# Altium schematic sheet Schematic.SchDoc
size Legal
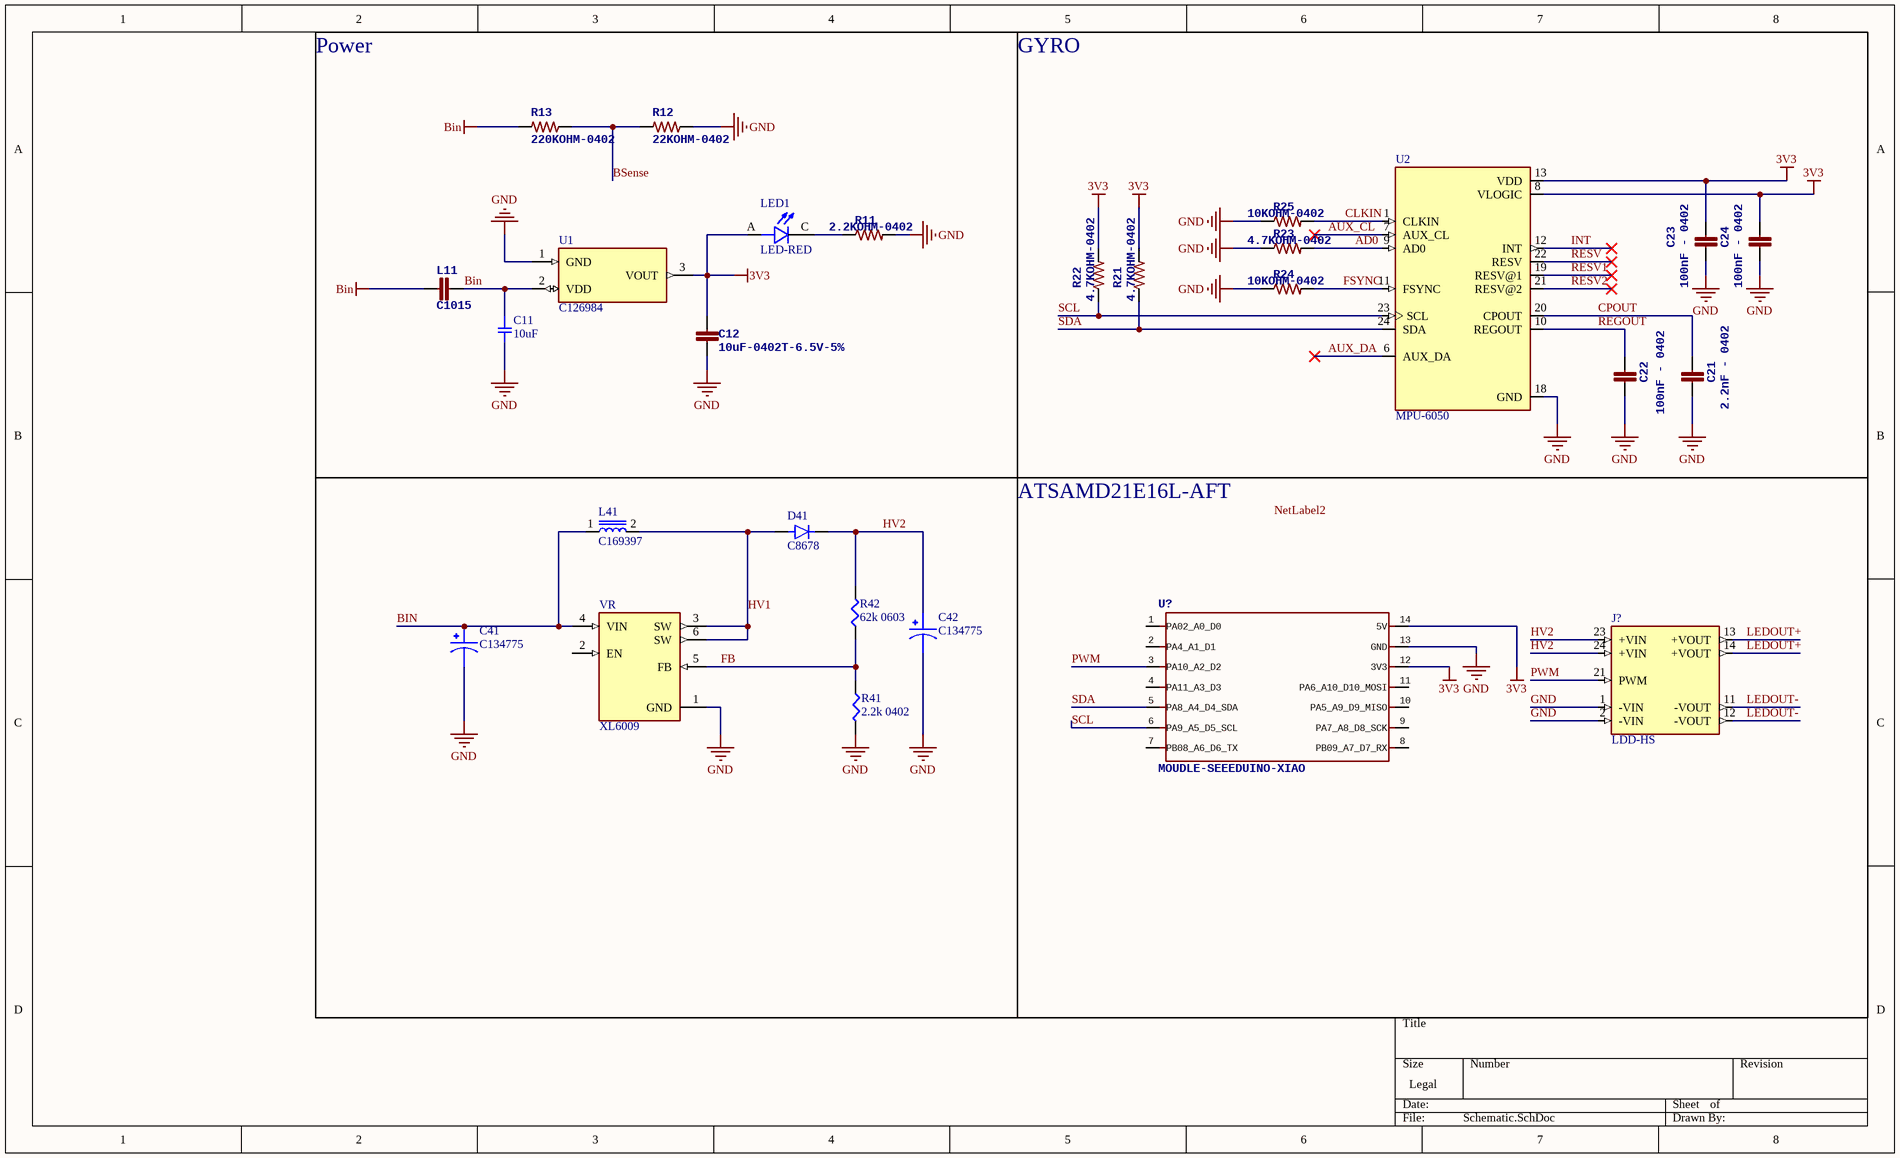
[diagram p0: Schematic.SchDoc]

## Parts
C11  10uF  [SMD-1206C]
C12  10uF-0402T-6.5V-5%  [0402-TIGHT]
C21  2.2nF - 0402  [0402]
C22  100nF - 0402  [0402]
C23  100nF - 0402  [0402]
C24  100nF - 0402  [0402]
C41  C134775  [CAPAE660X800N]
C42  C134775  [CAPAE660X800N]
D41  C8678  [DIOM5227X270N]
J?  LDD-HS  [LDD-HS]
L11  C1015  [0805]
L41  C169397  [INDM1250X1250X600]
LED1  LED-RED  [LEDSC160X80X90-2N]
R11  2.2KOHM-0402  [0402_MURATA]
R12  22KOHM-0402  [0402_MURATA]
R13  220KOHM-0402  [0402_MURATA]
R21  4.7KOHM-0402  [0402_MURATA]
R22  4.7KOHM-0402  [0402_MURATA]
R23  4.7KOHM-0402  [0402_MURATA]
R24  10KOHM-0402  [0402_MURATA]
R25  10KOHM-0402  [0402_MURATA]
R41  2.2k 0402  [SMD-0402-RES]
R42  62k 0603  [SMD-0603-RES]
U1  C126984  [VREG_TL431AQPK]
U2  MPU-6050  [QFN50P400X400X95-24N]
U?  MOUDLE-SEEEDUINO-XIAO  [MOUDLE14P-2.54-21X17.8MM]
VR  XL6009  [DPAK170P1435X465-6N]

## Blocks framed on the sheet
GYRO: C21-C24 R21-R25 U2

## Nets
3V3: C12.1 C23.2 C24.2 LED1.A R21.P$2 R22.P$2 U1.3(VOUT) U2.8(VLOGIC) U2.13(VDD) U?.12(3V3) U?.14(5V)
Bin: C11.1 C41.1 L11.1 L11.2 L41.1 R13.P$2 U1.2(VDD) VR.4(VIN)
GND: C11.2 C12.2 C21.1 C22.2 C23.1 C24.1 C41.2 C42.2 J?.1(-VIN) J?.2(-VIN) R11.P$2 R12.P$1 R23.P$1 R24.P$1 R25.P$1 R41.2 U1.1(GND) U2.18(GND) U?.13(GND) VR.1(GND)
AD0: R23.P$2 U2.9(AD0)
AUX_CL: U2.7(AUX_CL)
AUX_DA: U2.6(AUX_DA)
BSense: R12.P$2 R13.P$1
CLKIN: R25.P$2 U2.1(CLKIN)
CPOUT: C21.2 U2.20(CPOUT)
FB: R41.1 R42.1 VR.5(FB)
FSYNC: R24.P$2 U2.11(FSYNC)
HV1: D41.A L41.2 VR.3(SW) VR.6(SW)
HV2: C42.1 D41.C(K) J?.23(+VIN) J?.24(+VIN) R42.2
INT: U2.12(INT)
LEDOUT+: J?.13(+VOUT) J?.14(+VOUT)
LEDOUT-: J?.11(-VOUT) J?.12(-VOUT)
PWM: J?.21(PWM) U?.3(PA10_A2_D2)
REGOUT: C22.1 U2.10(REGOUT)
RESV: U2.22(RESV)
RESV1: U2.19(RESV@1)
RESV2: U2.21(RESV@2)
SCL: R22.P$1 U2.23(SCL) U?.6(PA9_A5_D5_SCL)
SDA: R21.P$1 U2.24(SDA) U?.5(PA8_A4_D4_SDA)
NetLED1_C: LED1.C R11.P$1

Not connected (* = marked no-connect by the designer): U? 1(PA02_A0_D0) 2(PA4_A1_D1) 4(PA11_A3_D3) 7(PB08_A6_D6_TX) 8(PB09_A7_D7_RX) 9(PA7_A8_D8_SCK) 10(PA5_A9_D9_MISO) 11(PA6_A10_D10_MOSI); VR 2(EN)

## Notes on the sheet
- Power
- ATSAMD21E16L-AFT
- Labels drawn without touching a wire or pin: NetLabel2

## Library data of the parts
C11 = GCJ31CR71A106KA13L: C13585; Manufacturer: Murata Electronics North America; Factory Stock: 0; Unit Price (USD): 0.71; Minimum Quantity: 1; Value: 10µF; Tolerance: ±10%; Voltage: 10V; Temperature Coefficient: X7R; Datasheets: http://www.murata.com/~/media/webrenewal/support/library/catalog/products/capacitor/mlcc/c03e.ashx; Image: //media.digikey.com/Renders/Murata%20Renders/GR331BD72E473KW01L.jpg; Digi-Key Part Number: 490-5848-1-ND; Part Number: GCJ31CR71A106KA13L; Quantity Available: 33084; @ qty: 0; Packaging: Cut Tape (CT); Series: GCJ; Part Status: Active; Operating Temperature: -55°C ~ 125°C; Features: Soft Termination; Ratings: AEC-Q200; Applications: Automotive, Boardflex Sensitive; Mounting Type: Surface Mount, MLCC; Package / Case: 1206 (3216 Metric); Size / Dimension: 0.126" L x 0.063" W (3.20mm x 1.60mm); Height - Seated (Max): -; Thickness (Max): 0.063" (1.60mm); Lead Spacing: -; Lead Style: -
C12 = 20PF-0402T-50V-5%: C15525; PROD_ID: CAP-14843
C21 = 0.1UF-0402-10V-10%-X7R: C1531; PROD_ID: CAP-15083
C22-C24 = 0.1UF-0402-10V-10%-X7R: C307331; PROD_ID: CAP-15083
C41 C42 = EEE-HC1E470XP: 47ÂµF 25V Aluminum Electrolytic Capacitors Radial, Can - SMD 3000 Hrs @ 105Â°C; MF: Panasonic Electronic; Package: Radial Panasonic Electronic; Availability: Unavailable; Value: *; MP: EEE-HC1E470XP; Price: None; SnapEDA_Link: https://www.snapeda.com/parts/EEE-HC1E470XP/Panasonic%20Electronic%20Components/view-part/970368/?ref=snap
D41 = S1M: Diode Standard 1000V 1A Surface Mount SMA _DO-214AC_; MF: ON Semiconductor; Package: DO-214AC-214 ON Semiconductor; Value: *; Price: None; MP: S1M; Availability: Unavailable; SnapEDA_Link: https://www.snapeda.com/parts/S1M/ON%20Semiconductor/view-part/1653505/?ref=snap
J? = LDD-HS: LED Power Supplies; MF: MEAN WELL; Package: None; Check_prices: https://www.snapeda.com/parts/LDD-HS/Mean%20Well/view-part/3218461/?ref=eda; Availability: Bad; Value: *; MP: LDD-HS; SnapEDA_Link: https://www.snapeda.com/parts/LDD-HS/Mean%20Well/view-part/3218461/?ref=snap; Price: None
L11 = 22UF-0805-16V-20%: PROD_ID: CAP-14260
L41 = DR125-3R3-R: 3.3ÂµH Shielded Wirewound Inductor 9.26A 6.3mOhm Nonstandard; MF: Eaton; Package: Nonstandard Eaton; Value: *; SnapEDA_Link: https://www.snapeda.com/parts/DR125-3R3-R/Eaton/view-part/1138667/?ref=snap; Availability: Unavailable; MP: DR125-3R3-R; Price: None
LED1 = LTST-C190KGKT: C2286; MP: LTSTC190KGKT; MF: Lite-On Inc.; SnapEDA_Link: https://www.snapeda.com/parts/LTSTC190KGKT/Lite-On%20Inc./view-part/1231104/?ref=snap; Availability: Unavailable; Price: None; Package: 0603 Lite-On Inc.; Value: *
R11 = 4.3KOHM-0402: C25879; PROD_ID: RES-14355
R12 = 4.3KOHM-0402: C25768; PROD_ID: RES-14355
R13 = 4.3KOHM-0402: C25767; PROD_ID: RES-14355
R21-R23 = 4.3KOHM-0402: C25900; PROD_ID: RES-14355
R24 R25 = 4.3KOHM-0402: C25744; PROD_ID: RES-14355
R41 = ERJ-2BQFR27X: C25879; Manufacturer: Panasonic Electronic Components; Factory Stock: 0; Unit Price (USD): 0.10080; @ qty: 1500; Minimum Quantity: 1; Value: 0.27; Tolerance: ±1%; Power (Watts): 0.167W, 1/6W; Temperature Coefficient: ±250ppm/°C; Part Number: ERJ-2BQFR27X; Datasheets: https://industrial.panasonic.com/cdbs/www-data/pdf/RDA0000/AOA0000C239.pdf; Image: //media.digikey.com/Photos/Panasonic%20Photos/ERJ-PA2-Series.jpg; Digi-Key Part Number: P.27AKCT-ND; Quantity Available: 37382; Packaging: Cut Tape (CT); Series: ERJ; Part Status: Active; Composition: Thick Film; Features: Automotive AEC-Q200, Current Sense; Operating Temperature: -55°C ~ 125°C; Package / Case: 0402 (1005 Metric); Supplier Device Package: 0402; Size / Dimension: 0.039" L x 0.020" W (1.00mm x 0.50mm); Height - Seated (Max): 0.016" (0.40mm); Number of Terminations: 2; Failure Rate: -
R42 = ERJ-PA3J912V: C23221; Manufacturer: Panasonic Electronic Components; Factory Stock: 0; Unit Price (USD): 0.01646; @ qty: 1500; Minimum Quantity: 1; Value: 9.1k; Tolerance: ±5%; Power (Watts): 0.25W, 1/4W; Temperature Coefficient: ±200ppm/°C; Part Number: ERJ-PA3J912V; Datasheets: https://industrial.panasonic.com/cdbs/www-data/pdf/RDA0000/AOA0000C243.pdf; Image: //media.digikey.com/Photos/Panasonic%20Photos/MFG_ERJ-P6W%20Series.jpg; Digi-Key Part Number: P9.1KBZCT-ND; Quantity Available: 4905; Packaging: Cut Tape (CT); Series: ERJ; Part Status: Active; Composition: Thick Film; Features: Automotive AEC-Q200, Pulse Withstanding; Operating Temperature: -55°C ~ 155°C; Package / Case: 0603 (1608 Metric); Supplier Device Package: 0603; Size / Dimension: 0.063" L x 0.031" W (1.60mm x 0.80mm); Height - Seated (Max): 0.022" (0.55mm); Number of Terminations: 2; Failure Rate: -
U1 = TL431AQPK: Fixed 40V 3.3V 60mV @ 10mA(typ) SOT-89(SOT-89-3) Dropout Regulators(LDO) RoHS; MF: Texas Instruments; Package: SOT-89-3 Texas Instruments; SnapEDA_Link: https://www.snapeda.com/parts/TL431AQPK/Texas%20Instruments/view-part/269428/?ref=snap; MP: TL431AQPK; Value: *; Digi-Key_Part_Number: 296-18236-1-ND; Digi-Key_Purchase_URL: https://www.digikey.com/product-detail/en/texas-instruments/TL431AQPK/296-18236-1-ND/807060?utm_source=snapeda&utm_medium=aggregator&utm_campaign=symbol
U2 = MPU-6050: Accelerometer, Gyroscope, 6 Axis Sensor IÂ²C Output; MF: TDK InvenSense; Price: None; Package: VFQFN-24 TDK InvenSense; MP: MPU-6050; Value: *; Availability: Unavailable; SnapEDA_Link: https://www.snapeda.com/parts/MPU-6050/TDK%20InvenSense/view-part/4503180/?ref=snap
VR = XL6009: The XL6009 regulator is a wide input range, current mode, DC/DC converter which is capable of generating either positive or negative output voltages.; MF: XLSEMI; MP: XL6009; Price: None; Availability: Unavailable; Package: Package Analog Devices; SnapEDA_Link: https://www.snapeda.com/parts/XL6009/XLSEMI/view-part/2888428/?ref=snap; Value: *